# EAGLE design ac_switching (EAGLE 9.6.2)
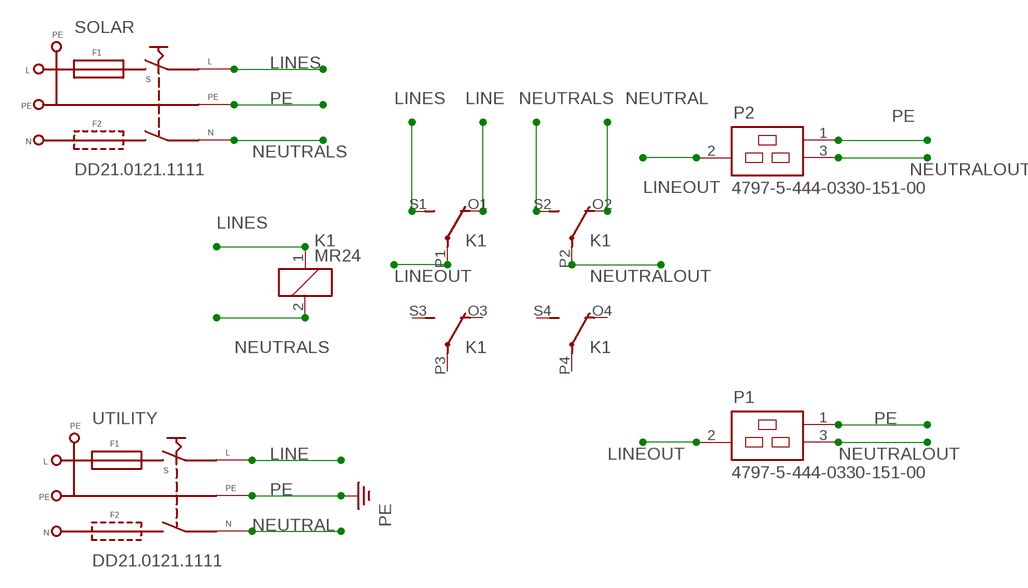
[diagram p0: schematic, sheet 1]

## Parts
K1  MR24  [MR24]
P1  4797-5-444-0330-151-00  [SCHURTER_4797-5-444-0330-151-00]
P2  4797-5-444-0330-151-00  [SCHURTER_4797-5-444-0330-151-00]
SOLAR  DD21.0121.1111  [SCHURTER_DD21.0121.1111]
UTILITY  DD21.0121.1111  [SCHURTER_DD21.0121.1111]

## Nets
LINE: K1.O1(2:O) UTILITY.L
LINEOUT: K1.P1(2:P) P1.2(NEUTRAL) P2.2(NEUTRAL)
LINES: K1.1 K1.S1(2:S) SOLAR.L
NEUTRAL: K1.O2(3:O) UTILITY.N
NEUTRALOUT: K1.P2(3:P) P1.3(LIVE) P2.3(LIVE)
NEUTRALS: K1.2 K1.S2(3:S) SOLAR.N
PE: P1.1(GND) P2.1(GND) SOLAR.PE UTILITY.PE
Unconnected: K1.O3(4:O) K1.O4(5:O) K1.P3(4:P) K1.P4(5:P) K1.S3(4:S) K1.S4(5:S)

## Library data of the parts
K1 = relay:MR24: RELAY 4 x switch
P1 P2 = 4797-5-444-0330-151-00:4797-5-444-0330-151-00: 4797-5 APPLIANCE OUTLET 16A 70 Check availability <https://pricing.snapeda.com/parts/4797-5-444-0330-151-00/Schurter%20Inc./view-part?ref=eda>; AVAILABILITY: In Stock; CHECK_PRICES: https://www.snapeda.com/parts/4797-5-444-0330-151-00/Schurter/view-part/?ref=eda; DESCRIPTION: Power Entry Connector Receptacle, Female Sockets IEC 320-2-2/J Panel Mount, Snap-In; Through Hole; MF: Schurter Inc.; MP: 4797-5-444-0330-151-00; PACKAGE: None; PRICE: None; PURCHASE-URL: https://www.snapeda.com/api/url_track_click_mouser/?unipart_id=5679205&manufacturer=Schurter Inc.&part_name=4797-5-444-0330-151-00&search_term=iec connector; SNAPEDA_LINK: https://www.snapeda.com/parts/4797-5-444-0330-151-00/Schurter/view-part/?ref=snap
SOLAR UTILITY = DD21.0121.1111:DD21.0121.1111: Power Entry Connector Receptacle, Male Blades - Module IEC 320-C14 Panel Mount, Flange; Through Hole, Right Angle Check availability <https://pricing.snapeda.com/parts/DD21.0121.1111/Schurter%20Inc./view-part?ref=eda>; AVAILABILITY: In Stock; CHECK_PRICES: https://www.snapeda.com/parts/DD21.0121.1111/Schurter+Inc./view-part/?ref=eda; DESCRIPTION: C14 Right Angle Through Hole IEC Conn Plug,Solder Term,Rated At 10A,250V ac | Schurter DD21.0121.1111; MF: Schurter Inc.; MP: DD21.0121.1111; PACKAGE: None; PRICE: None; PURCHASE-URL: https://www.snapeda.com/api/url_track_click_mouser/?unipart_id=262444&manufacturer=Schurter Inc.&part_name=DD21.0121.1111&search_term=iec connector; SNAPEDA_LINK: https://www.snapeda.com/parts/DD21.0121.1111/Schurter+Inc./view-part/?ref=snap

## Net classes
0 default: width 1.524 mm

## Board
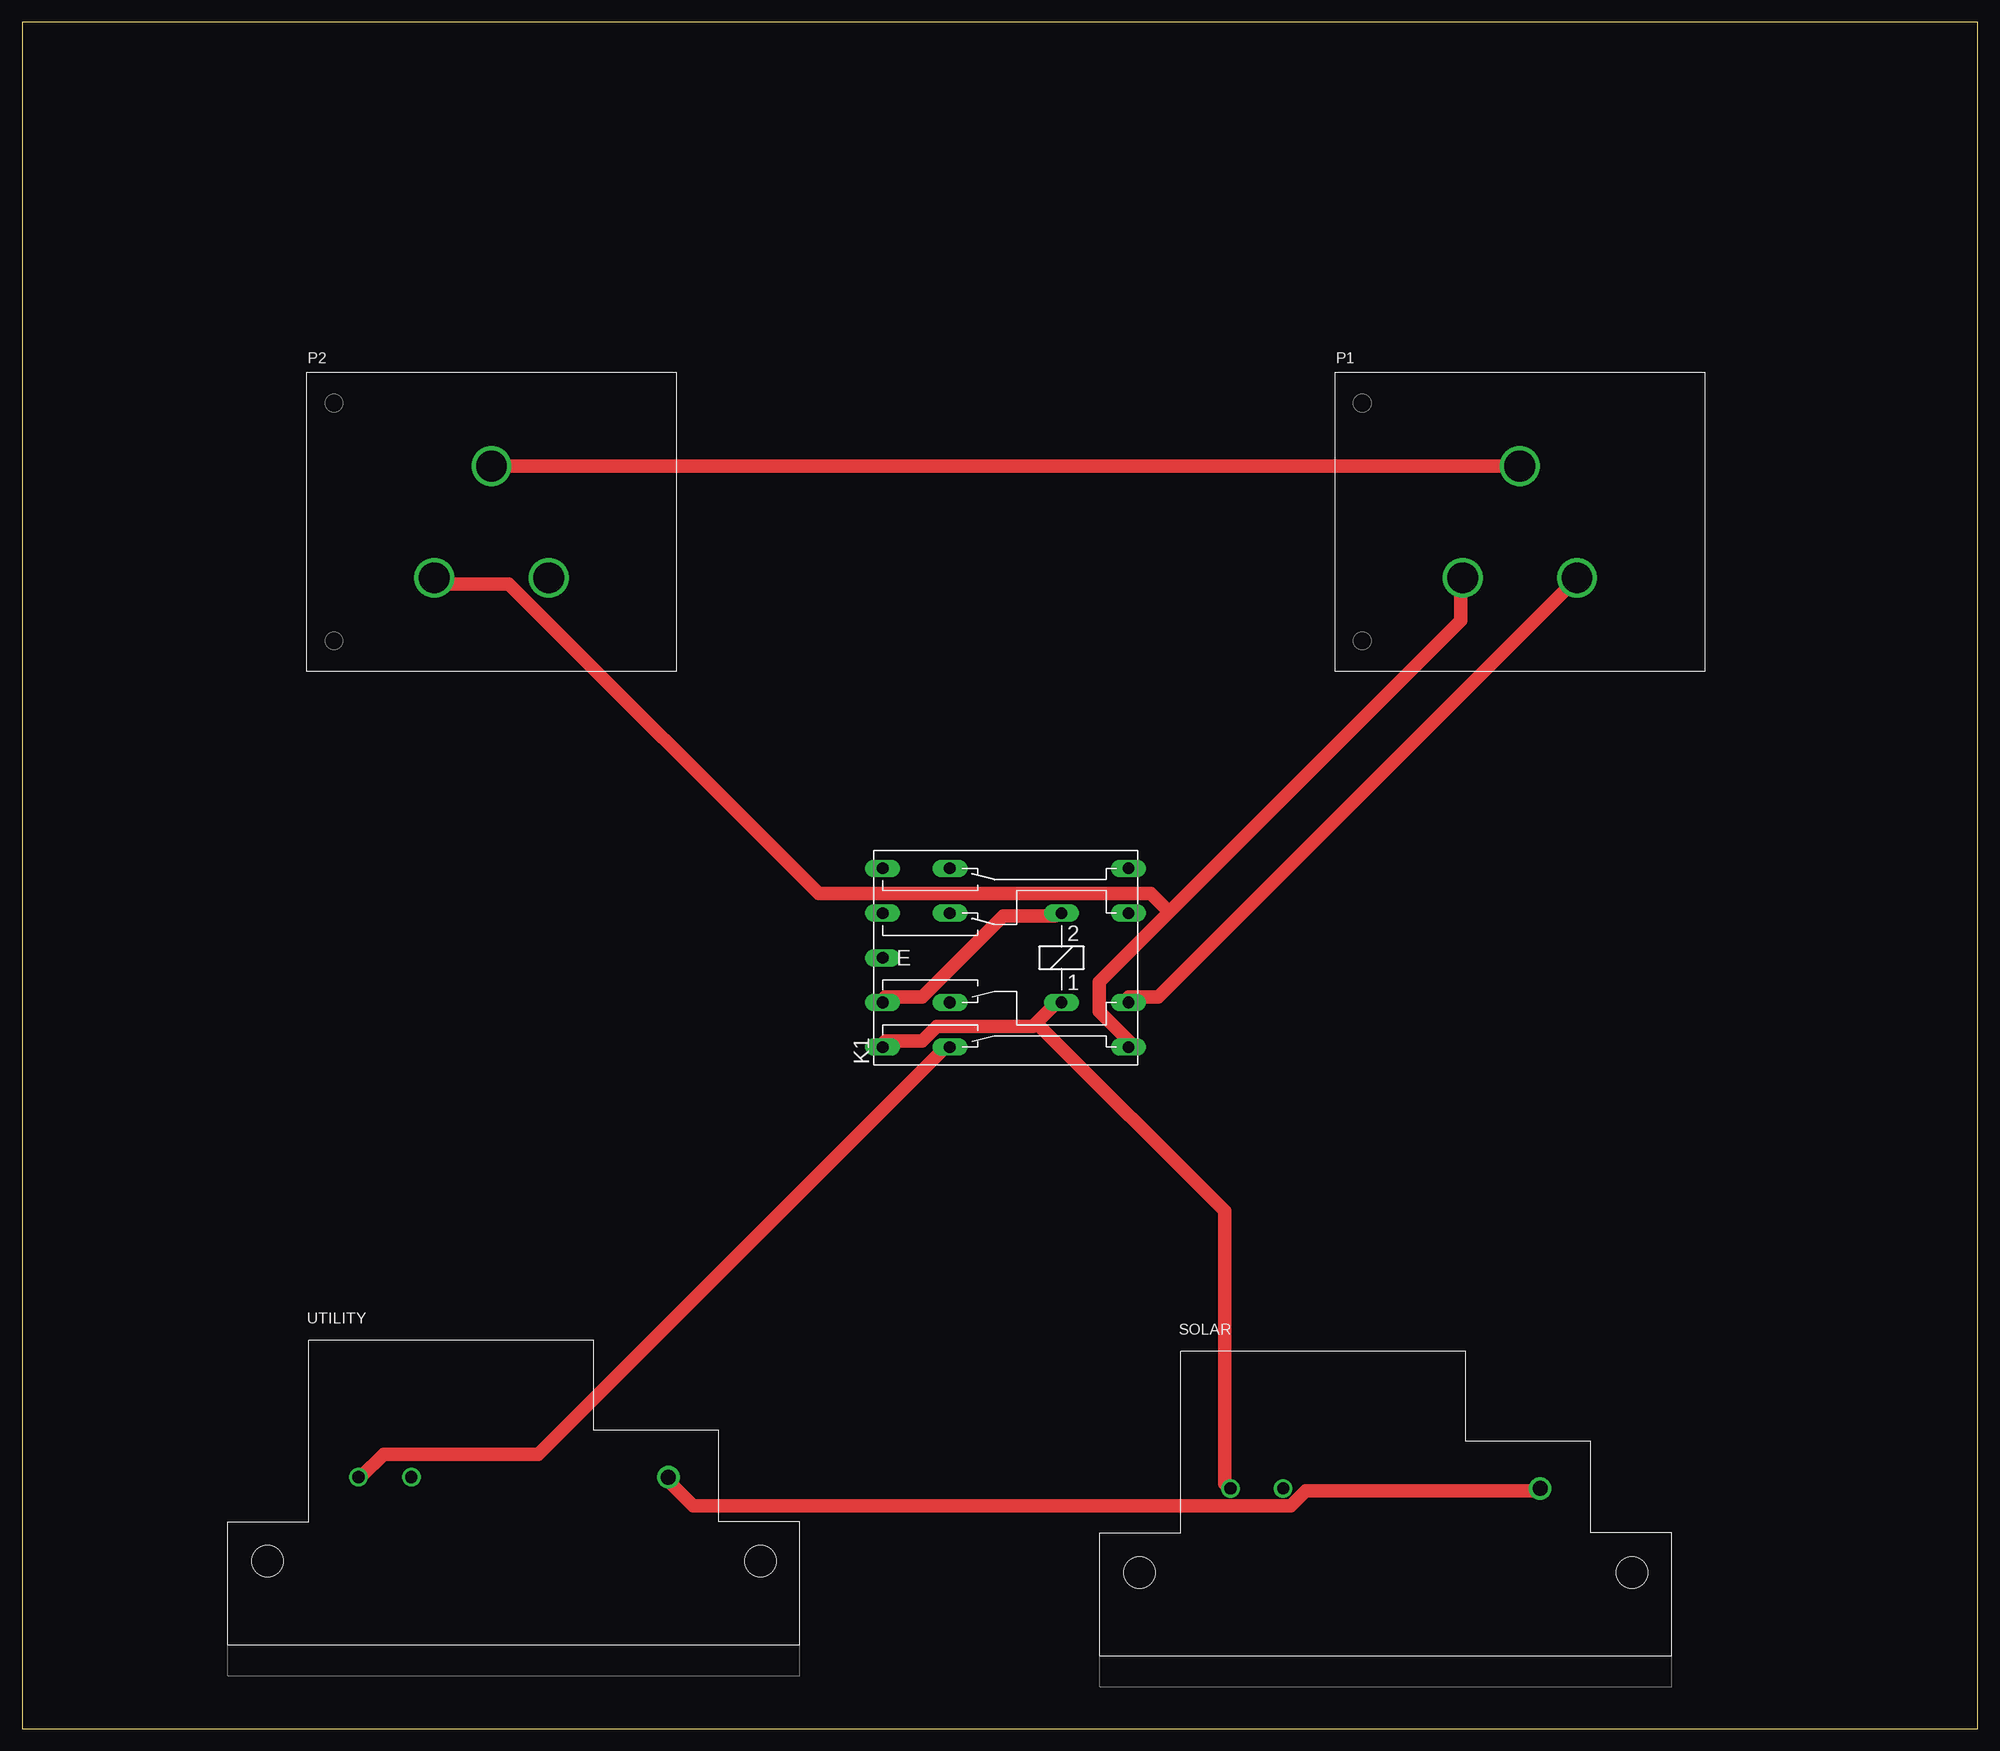
[diagram p1: board, top side]
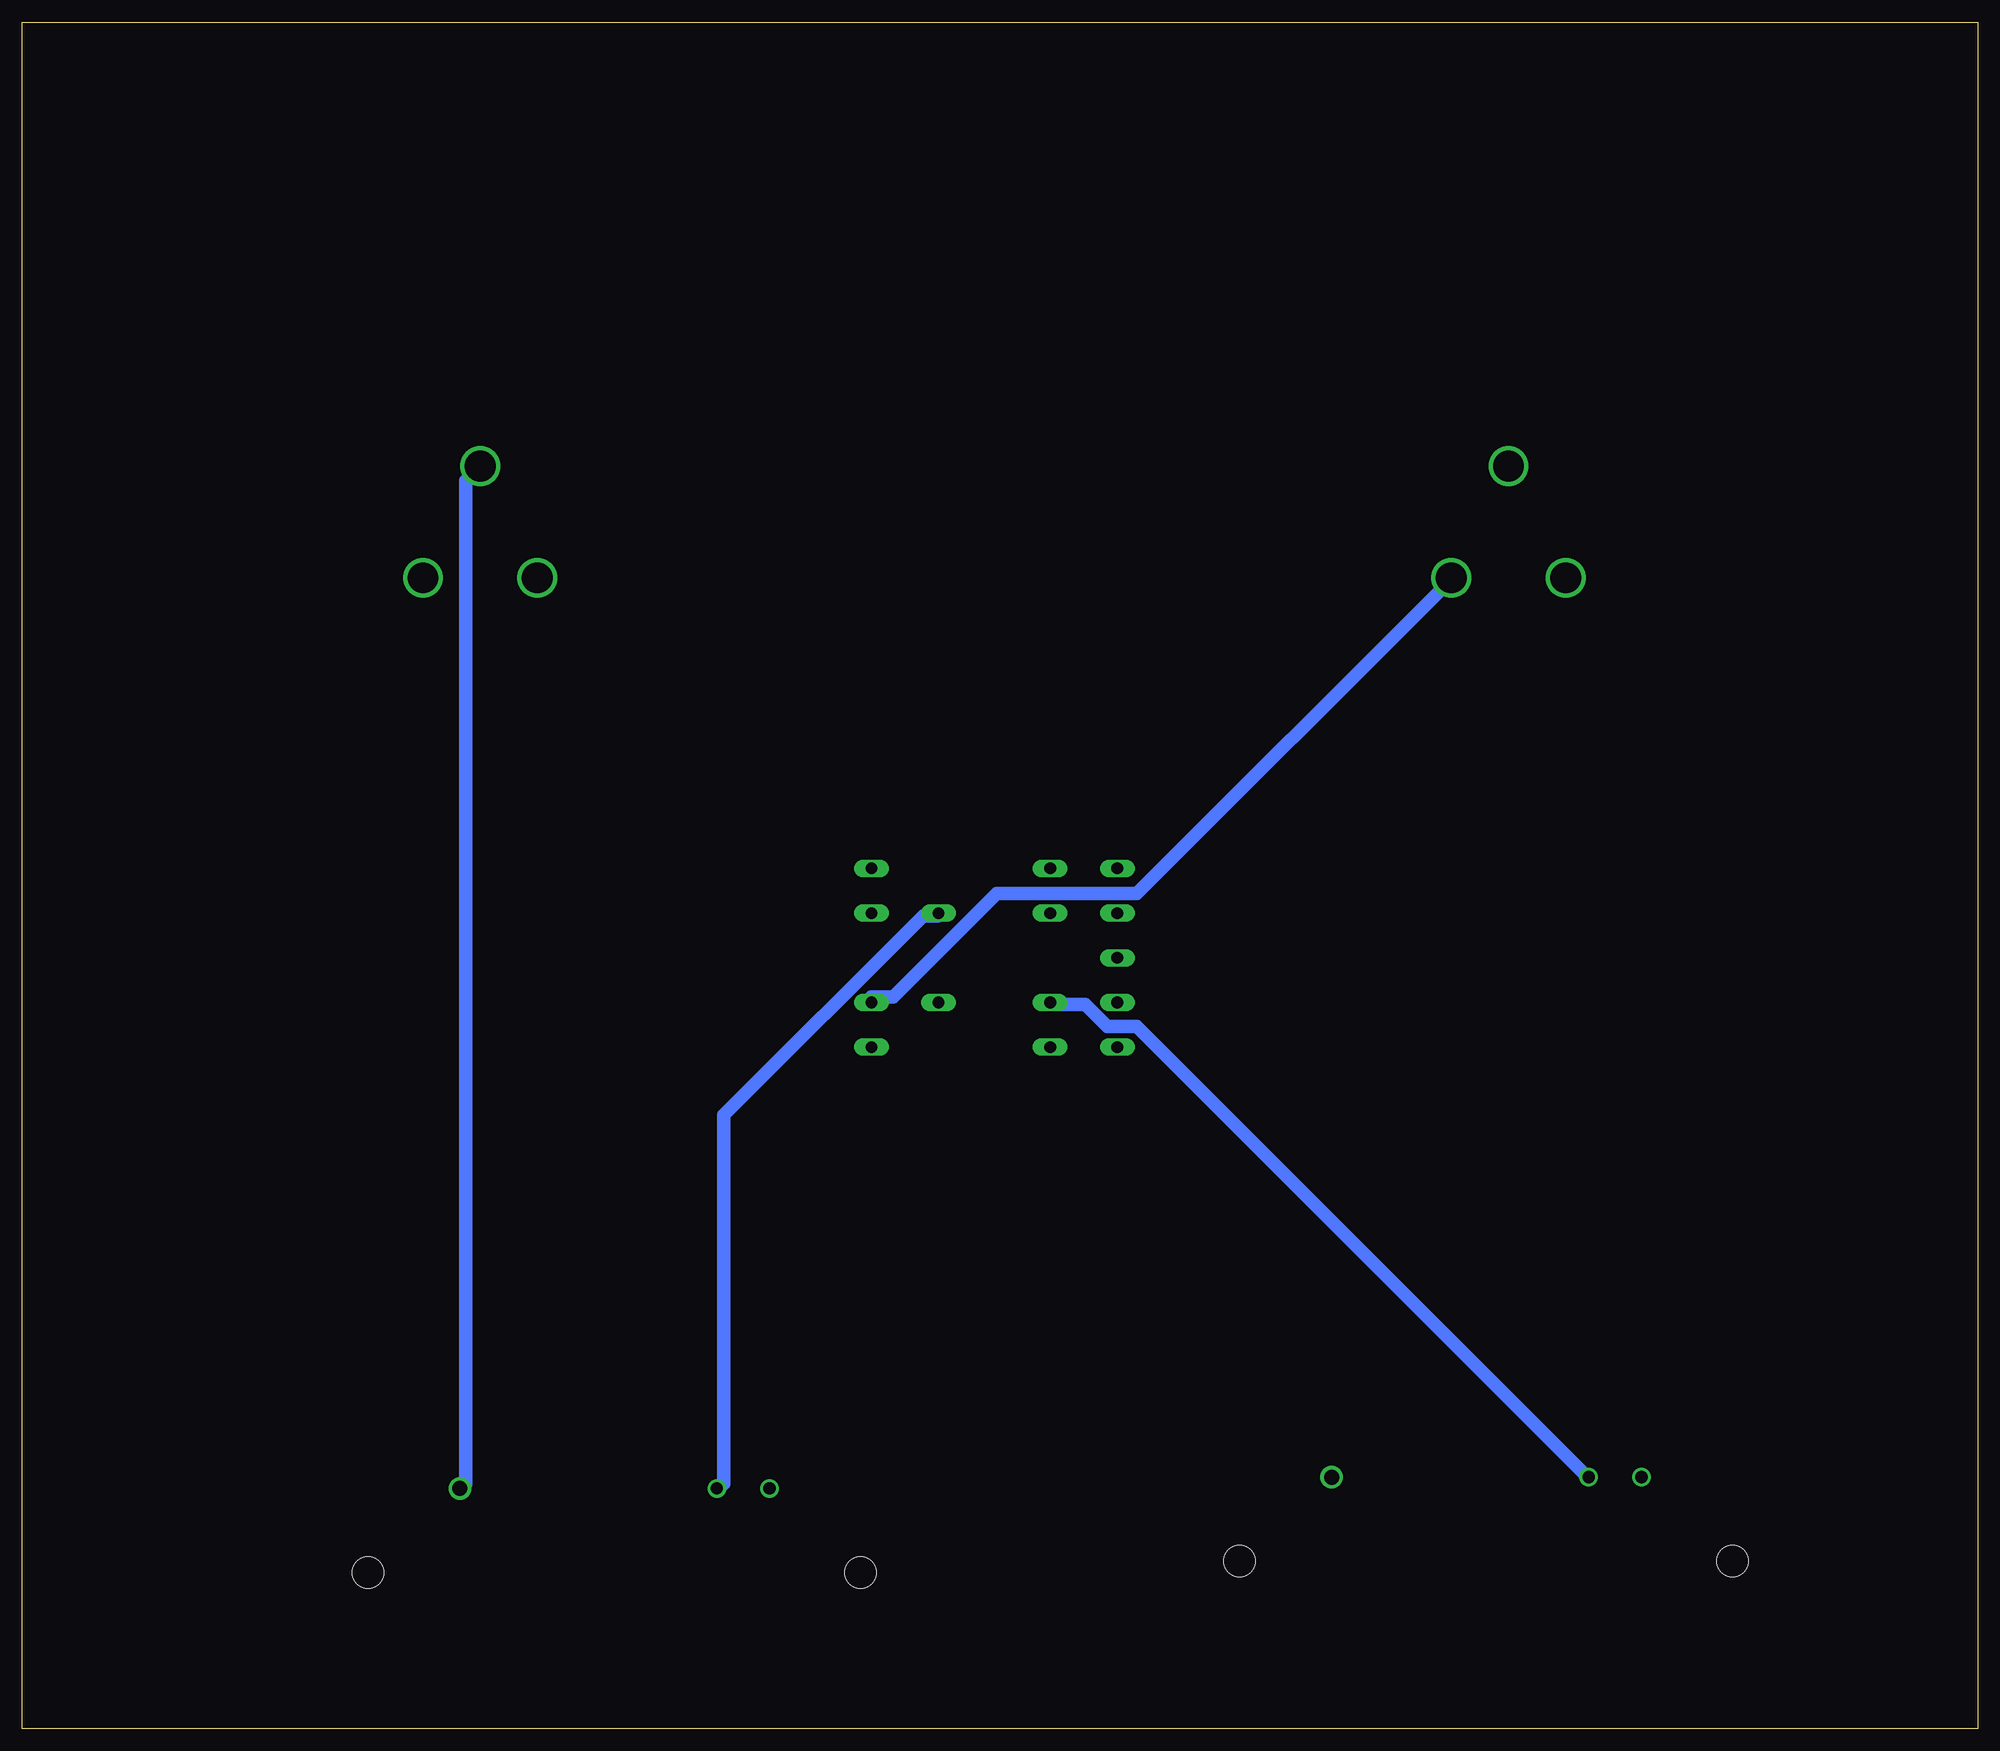
[diagram p2: board, bottom side, seen from below]

Size 222.23 x 193.98 mm. Coordinates in mm from the lower left corner, seen from the top.
Outline: 0,0 222.23,0 222.23,193.98 0,193.98 0,0
Copper layers (1*16): Top 0.035mm / dielectric 1.5mm / Bottom 0.035mm
Design rules "default": minimum track width 6mil, minimum drill 0.35mm, track to track 6mil, track to pad 6mil, pad to pad 6mil, via to via 6mil, smd to smd 6mil, copper to edge 40mil, drill to drill 6mil, minimum pad ring 10mil, minimum via ring 8mil, stop-mask expansion 4mil, vias tented up to drill 0mil, thermal gap 10mil

### Footprints (pad centres in the part's own frame; a part is rotated, then mirrored left to right if it is on the bottom)
MR24 = drill 1.321 long: 1 15.24,-5.08; 2 15.24,5.08; E -5.08,0; O1 2.54,-10.16; O2 2.54,-5.08; O3 2.54,5.08; O4 2.54,10.16; P1 22.86,-10.16; P2 22.86,-5.08; P3 22.86,5.08; P4 22.86,10.16; S1 -5.08,-10.16; S2 -5.08,-5.08; S3 -5.08,5.08; S4 -5.08,10.16
SCHURTER_4797-5-444-0330-151-00 = drill 3.5: 1 0,6.35; 2 -6.5,-6.35; 3 6.5,-6.35
SCHURTER_DD21.0121.1111 = drill 1.4: L -17.65,9.55; N -11.65,9.55 | drill 1.7: PE 17.55,9.55 | hole 3.6: -28,0; 28,0

### Placement (x,y rotation side)
K1  102.87,87.63 0 top
P1  170.18,137.16 0 top
P2  53.34,137.16 0 top
SOLAR  154.94,17.78 0 top
UTILITY  55.88,19.05 0 top

### Tracks (layer width: path | path; a pad name or v marks a point on that pad's centre or on a via)
LINE
  Top 1.524: K1.O1 104.78,77.32 58.67,31.22 41.07,31.22 38.56,28.7 UTILITY.L
LINEOUT
  Top 1.524: 130.34,92.82 163.45,125.93 163.45,130.12 P1.2 | 130.34,92.82 122.38,84.86 122.38,81.51 125.73,78.16 K1.P1 | 130.34,92.82 128.25,94.92 90.53,94.92 55.32,130.12 46.94,130.12 P2.2
LINES
  Top 1.524: 115.25,80.25 117.35,82.35 K1.1 | 115.25,80.25 114.83,79.83 103.94,79.83 102.26,78.16 98.07,78.16 K1.S1 | 115.25,80.25 136.63,58.88 136.63,27.86 SOLAR.L
NEUTRAL
  Bottom 1.524: K1.O2 104.78,82.35 101.42,82.35 98.91,79.83 95.56,79.83 44.42,28.7 UTILITY.N
NEUTRALOUT
  Top 1.524: K1.P2 125.73,83.19 129.08,83.19 176.02,130.12 P1.3
  Bottom 1.524: P2.3 60.35,130.12 95.56,94.92 111.48,94.92 123.22,83.19 125.73,83.19 K1.P2
NEUTRALS
  Top 1.524: K1.S2 98.07,83.19 102.26,83.19 111.48,92.41 117.35,92.41 K1.2
  Bottom 1.524: SOLAR.N 142.49,27.86 142.49,69.77 119.86,92.41 118.19,92.41 K1.2
PE
  Top 1.524: SOLAR.PE 171.83,27.03 145.85,27.03 144.17,25.35 76.28,25.35 73.76,27.86 UTILITY.PE | P2.1 53.65,143.53 170.16,143.53 P1.1
  Bottom 1.524: P1.1 171.83,141.86 171.83,27.86 SOLAR.PE